# Altium project ATmega32_ComServ.PrjPcb
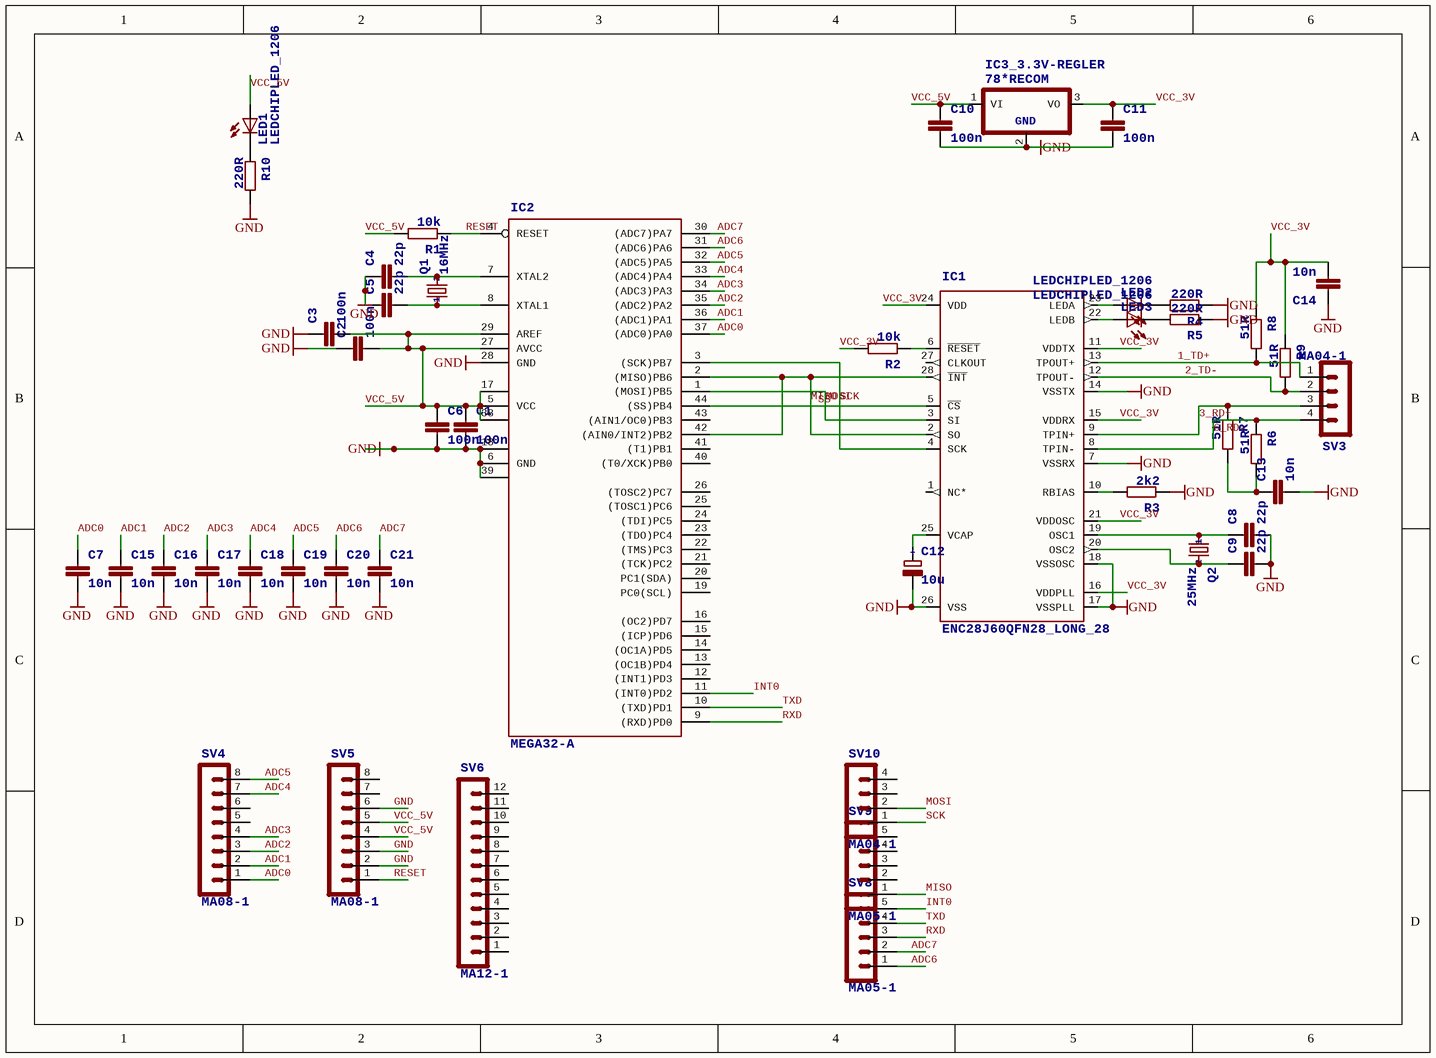
[diagram p0: ATmega32_ComServ.SchDoc]
1 sheet, 46 parts. Net scope: global (net labels, ports and power ports of the same name join across sheets).
Board file: ATmega32_ComServ.PcbDoc

## Sheet ATmega32_ComServ.SchDoc
size 251 x 185 mm

### Parts
C1  100n  [C0805]
C2  100n  [C0805]
C3  100n  [C0805]
C4  22p  [C0805]
C5  22p  [C0805]
C6  100n  [C0805]
C7  10n  [C0805]
C8  22p  [C0805]
C9  22p  [C0805]
C10  100n  [C0805]
C11  100n  [C0805]
C12  10u  [SMC_D]
C13  10n  [C0805]
C14  10n  [C0805]
C15  10n  [C0805]
C16  10n  [C0805]
C17  10n  [C0805]
C18  10n  [C0805]
C19  10n  [C0805]
C20  10n  [C0805]
C21  10n  [C0805]
IC1  ENC28J60QFN28_LONG_28  [QFN28_LONG_ERRLES]
IC2  MEGA32-A  [TQFP44]
IC3_3.3V-REGLER  78*RECOM  [RECOM_3POL]
LED1  LEDCHIPLED_1206  [CHIPLED_1206]
LED2  LEDCHIPLED_1206  [CHIPLED_1206]
LED3  LEDCHIPLED_1206  [CHIPLED_1206]
Q1  16MHz  [HC49/S]
Q2  25MHz  [HC49/S]
R1  10k  [R1206]
R2  10k  [R1206]
R3  2k2  [R1206]
R4  220R  [R1206]
R5  220R  [R1206]
R6  51R  [R0805]
R7  51R  [R1206]
R8  51R  [R0805]
R9  51R  [R0805]
R10  220R  [R1206]
SV3  MA04-1  [MA04-1]
SV4  MA08-1  [MA08-1]
SV5  MA08-1  [MA08-1]
SV6  MA12-1  [MA12-1]
SV8  MA05-1  [MA05-1]
SV9  MA05-1  [MA05-1]
SV10  MA04-1  [MA04-1]

### Nets
GND: C1.2 C2.1 C3.1 C4.1 C5.1 C6.2 C7.2 C8.2 C9.2 C10.2 C11.2 C12.- C13.2 C14.1 C15.2 C16.2 C17.2 C18.2 C19.2 C20.2 C21.2 IC1.7(VSSRX) IC1.14(VSSTX) IC1.17(VSSPLL) IC1.18(VSSOSC) IC1.26(VSS) IC2.6(GND) IC2.18(GND1) IC2.28(GND) IC2.39(GND2) IC3_3.3V-REGLER.2(GND) R3.1 R4.1 R5.1 R10.2 SV5.2 SV5.3 SV5.6
1_TD+: IC1.13(TPOUT+) R8.2 SV3.1
2_TD-: IC1.12(TPOUT-) R9.2 SV3.2
3_RD+: IC1.9(TPIN+) R7.1 SV3.3
6_RD-: IC1.8(TPIN-) R6.1 SV3.4
ADC0: C7.1 IC2.37((ADC0)PA0) SV4.1
ADC1: C15.1 IC2.36((ADC1)PA1) SV4.2
ADC2: C16.1 IC2.35((ADC2)PA2) SV4.3
ADC3: C17.1 IC2.34((ADC3)PA3) SV4.4
ADC4: C18.1 IC2.33((ADC4)PA4) SV4.7
ADC5: C19.1 IC2.32((ADC5)PA5) SV4.8
ADC6: C20.1 IC2.31((ADC6)PA6) SV8.1
ADC7: C21.1 IC2.30((ADC7)PA7) SV8.2
INT0: IC2.11((INT0)PD2) SV8.5
MISO: IC1.2(SO) IC1.28(~{INT}) IC2.2((MISO)PB6) IC2.42((AIN0/INT2)PB2) SV9.1
MOSI: IC1.3(SI) IC2.1((MOSI)PB5) SV10.2
RESET: IC2.4(RESET) R1.1 SV5.1
RXD: IC2.9((RXD)PD0) SV8.3
SCK: IC1.4(SCK) IC2.3((SCK)PB7) SV10.1
SS: IC1.5(~{CS}) IC2.44((SS)PB4)
TXD: IC2.10((TXD)PD1) SV8.4
VCC_3V: C11.1 C14.2 IC1.11(VDDTX) IC1.15(VDDRX) IC1.16(VDDPLL) IC1.21(VDDOSC) IC1.24(VDD) IC3_3.3V-REGLER.3(VO) R2.2 R8.1 R9.1
VCC_5V: C1.1 C2.2 C3.2 C6.1 C10.1 IC2.5(VCC) IC2.17(VCC1) IC2.27(AVCC) IC2.29(AREF) IC2.38(VCC2) IC3_3.3V-REGLER.1(VI) LED1.A R1.2 SV5.4 SV5.5
NetC4_2: C4.2 IC2.7(XTAL2) Q1.2
NetC5_2: C5.2 IC2.8(XTAL1) Q1.1
NetC8_1: C8.1 IC1.19(OSC1) Q2.1
NetC9_1: C9.1 IC1.20(OSC2) Q2.2
NetC12_+: C12.+ IC1.25(VCAP)
NetC13_1: C13.1 R6.2 R7.2
NetIC1_6: IC1.6(~{RESET}) R2.1
NetIC1_10: IC1.10(RBIAS) R3.2
NetIC1_22: IC1.22(LEDB) LED3.A
NetIC1_23: IC1.23(LEDA) LED2.A
NetLED1_C: LED1.C R10.1
NetLED2_C: LED2.C R4.2
NetLED3_C: LED3.C R5.2

Not connected (* = marked no-connect by the designer): IC1 1(NC*) 27(CLKOUT); IC2 12((INT1)PD3) 13((OC1B)PD4) 14((OC1A)PD5) 15((ICP)PD6) 16((OC2)PD7) 19(PC0(SCL)) 20(PC1(SDA)) 21((TCK)PC2) 22((TMS)PC3) 23((TDO)PC4) 24((TDI)PC5) 25((TOSC1)PC6) 26((TOSC2)PC7) 40((T0/XCK)PB0) 41((T1)PB1) 43((AIN1/OC0)PB3); SV4 5 6; SV5 7 8; SV6 1 2 3 4 5 6 7 8 9 10 11 12; SV9 2 3 4 5; SV10 3 4

### Library data of the parts
C1-C11 C13-C21 = C-EUC0805: <B>CAPACITOR</B>, European symbol
C12 = CPOL-EUSMCD: <B>POLARIZED CAPACITOR</B>, European symbol; +: +
IC1 = ENC28J60QFN28_LONG_28: <b>Stand-Alone Ethernet Controller with SPI Interface</b><p> / Source: http://ww1.microchip.com/downloads/en/DeviceDoc/39662c.pdf
IC2 = MEGA32-A: <b>MICROCONTROLLER</b><p> / 32 Kbytes FLASH<br> / 2 Kbytes SRAM<br> / 1 Kbytes EEPROM<br> / USART<br> / 8-channel 10 bit ADC<br> / Source: www.atmel.com .. doc2503.pdf
IC3_3.3V-REGLER = 78*RECOM: Positive <b>VOLTAGE REGULATOR</b><p> / Source:<br> / http://cache.national.com/ds/LM/LM78L05.pdf<br> / http://www.fairchildsemi.com/ds/LM/LM7805.pdf; GND: GND
LED1-LED3 = LEDCHIPLED_1206: <b>LED</b><p> / <u>OSRAM</u>:<br> / - <u>CHIPLED</u><br> / LG R971, LG N971, LY N971, LG Q971, LY Q971, LO R971, LY R971 / LH N974, LH R974<br> / LS Q976, LO Q976, LY Q976<br> / LO Q996<br> / - <u>Hyper CHIPLED</u><br> / LW Q18S<br> / LB Q993, LB Q99A, LB R99A<br> / - <u>SideLED</u><br> / LS A670, LO A670, LY A670, LG A670, LP A670<br> / LB A673, LV A673, LT A673, LW A673<br> / LH A674<br> / LY A675<br> / LS A676, LA A676, LO A676, LY A676, LW A676<br> / LS A679, LY A679, LG A679<br> / -  <u>Hyper Micro SIDELED®</u><br> / LS Y876, LA Y876, LO Y876, LY Y876<br> / LT Y87S<br> / - <u>SmartLED</u><br> / LW L88C, LW L88S<br> / LB L89C, LB L89S, LG L890<br> / LS L89K, LO L89K, LY L89K<br> / LS L896, LA L896, LO L896, LY L896<br> / - <u>TOPLED</u><br> / LS T670, LO T670, LY T670, LG T670, LP T670<br> / LSG T670, LSP T670, LSY T670, LOP T670, LYG T670<br> / LG T671, LOG T671, LSG T671<br> / LB T673, LV T673, LT T673, LW T673<br> / LH T674<br> / LS T676, LA T676, LO T676, LY T676, LB T676, LH T676, LSB T676, LW T676<br> / LB T67C, LV T67C, LT T67C, LS T67K, LO T67K, LY T67K, LW E67C<br> / LS E67B, LA E67B, LO E67B, LY E67B, LB E67C, LV E67C, LT E67C<br> / LW T67C<br> / LS T679, LY T679, LG T679<br> / LS T770, LO T770, LY T770, LG T770, LP T770<br> / LB T773, LV T773, LT T773, LW T773<br> / LH T774<br> / LS E675, LA E675, LY E675, LS T675<br> / LS T776, LA T776, LO T776, LY T776, LB T776<br> / LHGB T686<br> / LT T68C, LB T68C<br> / - <u>Hyper Mini TOPLED®</u><br> / LB M676<br> / - <u>Mini TOPLED Santana®</u><br> / LG M470<br> / LS M47K, LO M47K, LY M47K / <p> / Source: http://www.osram.convergy.de<p> / <u>LUXEON:</u><br> / - <u>LUMILED®</u><br> / LXK2-PW12-R00, LXK2-PW12-S00, LXK2-PW14-U00, LXK2-PW14-V00<br> / LXK2-PM12-R00, LXK2-PM12-S00, LXK2-PM14-U00<br> / LXK2-PE12-Q00, LXK2-PE12-R00, LXK2-PE12-S00, LXK2-PE14-T00, LXK2-PE14-U00<br> / LXK2-PB12-K00, LXK2-PB12-L00, LXK2-PB12-M00, LXK2-PB14-N00, LXK2-PB14-P00, LXK2-PB14-Q00<br> / LXK2-PR12-L00, LXK2-PR12-M00, LXK2-PR14-Q00, LXK2-PR14-R00<br> / LXK2-PD12-Q00, LXK2-PD12-R00, LXK2-PD12-S00<br> / LXK2-PH12-R00, LXK2-PH12-S00<br> / LXK2-PL12-P00, LXK2-PL12-Q00, LXK2-PL12-R00 / <p> / Source: www.luxeon.com<p> / <u>KINGBRIGHT:</U><p> / KA-3528ASYC<br> / Source: www.kingbright.com
Q1 Q2 = CRYSTALHC49S: <b>CRYSTAL</b>; 1: 1; 2: 2
R1-R5 R7 R10 = R-EU_R1206: <B>RESISTOR</B>, European symbol
R6 R8 R9 = R-EU_R0805: <B>RESISTOR</B>, European symbol
SV3 SV10 = MA04-1: <b>PIN HEADER</b>
SV4 SV5 = MA08-1: <b>PIN HEADER</b>
SV6 = MA12-1: <b>PIN HEADER</b>
SV8 SV9 = MA05-1: <b>PIN HEADER</b>